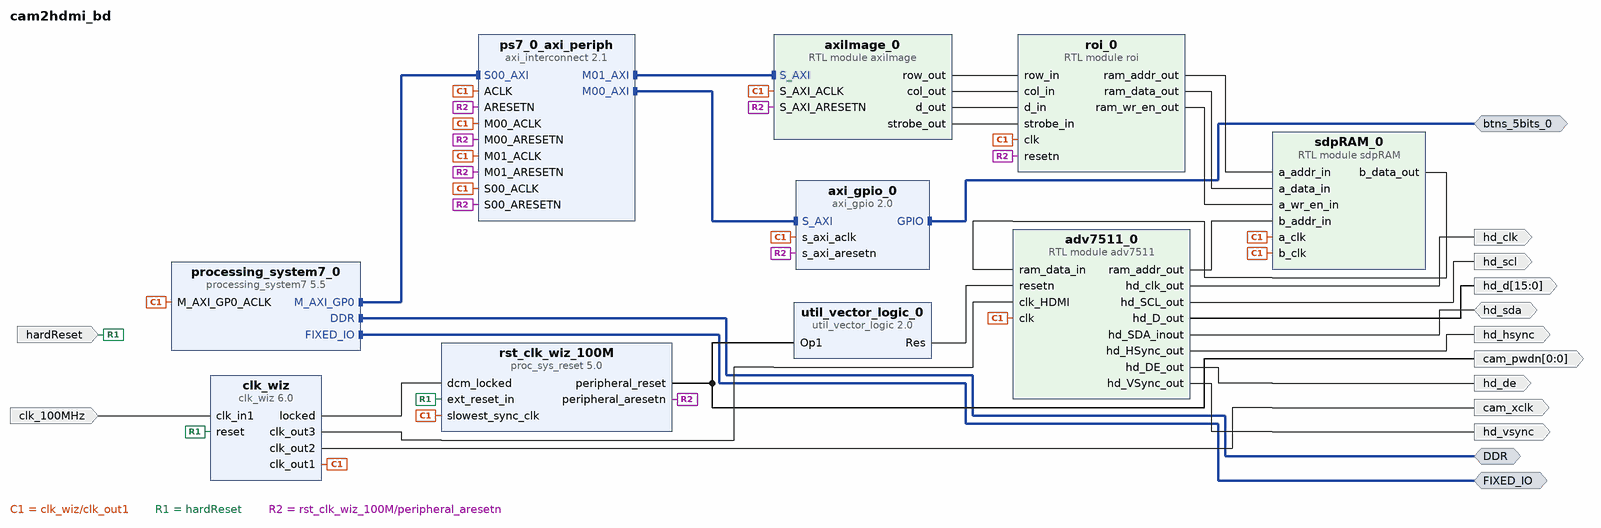
[diagram p0: block diagram of the top level]
# Vivado block design cam2hdmi_bd, xc7z020clg484-1, Vivado 2019.1
create_bd_design cam2hdmi_bd

create_bd_intf_port -mode Master -vlnv xilinx.com:interface:ddrx_rtl:1.0 DDR
create_bd_intf_port -mode Master -vlnv xilinx.com:display_processing_system7:fixedio_rtl:1.0 FIXED_IO
create_bd_intf_port -mode Master -vlnv xilinx.com:interface:gpio_rtl:1.0 btns_5bits_0
create_bd_port -dir I -type clk clk_100MHz
set_property -dict {CONFIG.FREQ_HZ 100000000} [get_bd_ports clk_100MHz]
create_bd_port -dir I -type rst hardReset
set_property -dict {CONFIG.POLARITY ACTIVE_HIGH} [get_bd_ports hardReset]
create_bd_port -dir O -from 0 -to 0 -type rst cam_pwdn
create_bd_port -dir O -type data hd_scl
create_bd_port -dir IO -type data hd_sda
create_bd_port -dir O -type data hd_clk
create_bd_port -dir O -type data hd_vsync
create_bd_port -dir O -type data hd_hsync
create_bd_port -dir O -from 15 -to 0 -type data hd_d
create_bd_port -dir O -type data hd_de
create_bd_port -dir O -type clk cam_xclk

create_bd_cell -type ip -vlnv xilinx.com:ip:util_vector_logic:2.0 util_vector_logic_0
set_property -dict {CONFIG.C_OPERATION not CONFIG.C_SIZE 1} [get_bd_cells util_vector_logic_0]
create_bd_cell -type ip -vlnv xilinx.com:ip:processing_system7:5.5 processing_system7_0
set_property -dict [list \
  CONFIG.PCW_APU_PERIPHERAL_FREQMHZ 666.6666666 \
  CONFIG.PCW_ENET0_ENET0_IO {MIO 16 .. 27} \
  CONFIG.PCW_ENET0_GRP_MDIO_ENABLE 1 \
  CONFIG.PCW_ENET0_GRP_MDIO_IO {MIO 52 .. 53} \
  CONFIG.PCW_ENET0_PERIPHERAL_ENABLE 1 \
  CONFIG.PCW_EN_CLK0_PORT 0 \
  CONFIG.PCW_FPGA0_PERIPHERAL_FREQMHZ 25 \
  CONFIG.PCW_FPGA1_PERIPHERAL_FREQMHZ 100 \
  CONFIG.PCW_GPIO_MIO_GPIO_ENABLE 0 \
  CONFIG.PCW_PERIPHERAL_BOARD_PRESET part0 \
  CONFIG.PCW_PRESET_BANK1_VOLTAGE {LVCMOS 1.8V} \
  CONFIG.PCW_QSPI_PERIPHERAL_ENABLE 0 \
  CONFIG.PCW_SD0_GRP_CD_ENABLE 0 \
  CONFIG.PCW_SD0_GRP_WP_ENABLE 0 \
  CONFIG.PCW_SD0_PERIPHERAL_ENABLE 1 \
  CONFIG.PCW_SD0_SD0_IO {MIO 40 .. 45} \
  CONFIG.PCW_SDIO_PERIPHERAL_FREQMHZ 50 \
  CONFIG.PCW_UART1_PERIPHERAL_ENABLE 1 \
  CONFIG.PCW_UART1_UART1_IO {MIO 48 .. 49} \
  CONFIG.PCW_UART_PERIPHERAL_FREQMHZ 100 \
  CONFIG.PCW_UIPARAM_DDR_FREQ_MHZ 533.333333 \
  CONFIG.PCW_UIPARAM_DDR_PARTNO {MT41J128M16 HA-15E} \
  CONFIG.PCW_USB0_PERIPHERAL_ENABLE 0 \
  CONFIG.preset ZedBoard \
] [get_bd_cells processing_system7_0]
# 407 more settings of processing_system7_0 are not shown: defaults, MIO pin electricals, DDR timing, and values the tool derives
create_bd_cell -type ip -vlnv xilinx.com:ip:clk_wiz:6.0 clk_wiz
set_property -dict [list \
  CONFIG.CLKOUT2_JITTER 175.402 \
  CONFIG.CLKOUT2_PHASE_ERROR 98.575 \
  CONFIG.CLKOUT2_REQUESTED_OUT_FREQ 25 \
  CONFIG.CLKOUT2_USED true \
  CONFIG.CLKOUT3_JITTER 130.958 \
  CONFIG.CLKOUT3_PHASE_ERROR 98.575 \
  CONFIG.CLKOUT3_USED true \
  CONFIG.MMCM_CLKOUT1_DIVIDE 40 \
  CONFIG.MMCM_CLKOUT2_DIVIDE 10 \
  CONFIG.MMCM_DIVCLK_DIVIDE 1 \
  CONFIG.NUM_OUT_CLKS 3 \
] [get_bd_cells clk_wiz]
create_bd_cell -type ip -vlnv xilinx.com:ip:proc_sys_reset:5.0 rst_clk_wiz_100M
set_property -dict {CONFIG.C_AUX_RST_WIDTH 1 CONFIG.C_EXT_RST_WIDTH 1} [get_bd_cells rst_clk_wiz_100M]
create_bd_cell -type module -reference adv7511 adv7511_0
set_property -dict [list \
  CONFIG.imSizeH_g 480 \
  CONFIG.imSizeV_g 360 \
  CONFIG.ramAddressSize_g 18 \
  CONFIG.upscalingFactor_g 2 \
] [get_bd_cells adv7511_0]
create_bd_cell -type ip -vlnv xilinx.com:ip:axi_interconnect:2.1 ps7_0_axi_periph
set_property -dict {CONFIG.NUM_MI 2} [get_bd_cells ps7_0_axi_periph]
create_bd_cell -type ip -vlnv xilinx.com:ip:axi_gpio:2.0 axi_gpio_0
set_property -dict {CONFIG.GPIO_BOARD_INTERFACE btns_5bits CONFIG.USE_BOARD_FLOW true} [get_bd_cells axi_gpio_0]
create_bd_cell -type module -reference sdpRAM sdpRAM_0
create_bd_cell -type module -reference roi roi_0
create_bd_cell -type module -reference axiImage axiImage_0

# ---- connections ----

connect_bd_intf_net [get_bd_intf_ports btns_5bits_0] [get_bd_intf_pins axi_gpio_0/GPIO]
connect_bd_intf_net [get_bd_intf_pins processing_system7_0/M_AXI_GP0] [get_bd_intf_pins ps7_0_axi_periph/S00_AXI]
connect_bd_intf_net [get_bd_intf_pins ps7_0_axi_periph/M01_AXI] [get_bd_intf_pins axiImage_0/S_AXI]
connect_bd_intf_net [get_bd_intf_ports DDR] [get_bd_intf_pins processing_system7_0/DDR]
connect_bd_intf_net [get_bd_intf_pins ps7_0_axi_periph/M00_AXI] [get_bd_intf_pins axi_gpio_0/S_AXI]
connect_bd_intf_net [get_bd_intf_ports FIXED_IO] [get_bd_intf_pins processing_system7_0/FIXED_IO]
connect_bd_net [get_bd_pins clk_wiz/clk_out1] \
  [get_bd_pins processing_system7_0/M_AXI_GP0_ACLK] [get_bd_pins rst_clk_wiz_100M/slowest_sync_clk] \
  [get_bd_pins adv7511_0/clk] [get_bd_pins ps7_0_axi_periph/S00_ACLK] [get_bd_pins ps7_0_axi_periph/M00_ACLK] \
  [get_bd_pins ps7_0_axi_periph/ACLK] [get_bd_pins axi_gpio_0/s_axi_aclk] [get_bd_pins sdpRAM_0/a_clk] \
  [get_bd_pins sdpRAM_0/b_clk] [get_bd_pins roi_0/clk] [get_bd_pins axiImage_0/S_AXI_ACLK] \
  [get_bd_pins ps7_0_axi_periph/M01_ACLK]
connect_bd_net [get_bd_pins clk_wiz/locked] [get_bd_pins rst_clk_wiz_100M/dcm_locked]
connect_bd_net [get_bd_ports clk_100MHz] [get_bd_pins clk_wiz/clk_in1]
connect_bd_net [get_bd_ports hardReset] [get_bd_pins clk_wiz/reset] [get_bd_pins rst_clk_wiz_100M/ext_reset_in]
connect_bd_net [get_bd_pins rst_clk_wiz_100M/peripheral_reset] [get_bd_ports cam_pwdn] [get_bd_pins util_vector_logic_0/Op1]
connect_bd_net [get_bd_pins util_vector_logic_0/Res] [get_bd_pins adv7511_0/resetn]
connect_bd_net [get_bd_pins adv7511_0/hd_SCL_out] [get_bd_ports hd_scl]
connect_bd_net [get_bd_ports hd_sda] [get_bd_pins adv7511_0/hd_SDA_inout]
connect_bd_net [get_bd_pins adv7511_0/hd_clk_out] [get_bd_ports hd_clk]
connect_bd_net [get_bd_pins adv7511_0/hd_VSync_out] [get_bd_ports hd_vsync]
connect_bd_net [get_bd_pins adv7511_0/hd_HSync_out] [get_bd_ports hd_hsync]
connect_bd_net [get_bd_pins adv7511_0/hd_D_out] [get_bd_ports hd_d]
connect_bd_net [get_bd_pins adv7511_0/hd_DE_out] [get_bd_ports hd_de]
connect_bd_net [get_bd_pins clk_wiz/clk_out2] [get_bd_ports cam_xclk]
connect_bd_net [get_bd_pins clk_wiz/clk_out3] [get_bd_pins adv7511_0/clk_HDMI]
connect_bd_net [get_bd_pins rst_clk_wiz_100M/peripheral_aresetn] \
  [get_bd_pins ps7_0_axi_periph/S00_ARESETN] [get_bd_pins ps7_0_axi_periph/M00_ARESETN] \
  [get_bd_pins ps7_0_axi_periph/ARESETN] [get_bd_pins axi_gpio_0/s_axi_aresetn] [get_bd_pins roi_0/resetn] \
  [get_bd_pins axiImage_0/S_AXI_ARESETN] [get_bd_pins ps7_0_axi_periph/M01_ARESETN]
connect_bd_net [get_bd_pins roi_0/ram_addr_out] [get_bd_pins sdpRAM_0/a_addr_in]
connect_bd_net [get_bd_pins roi_0/ram_data_out] [get_bd_pins sdpRAM_0/a_data_in]
connect_bd_net [get_bd_pins roi_0/ram_wr_en_out] [get_bd_pins sdpRAM_0/a_wr_en_in]
connect_bd_net [get_bd_pins sdpRAM_0/b_data_out] [get_bd_pins adv7511_0/ram_data_in]
connect_bd_net [get_bd_pins axiImage_0/row_out] [get_bd_pins roi_0/row_in]
connect_bd_net [get_bd_pins axiImage_0/col_out] [get_bd_pins roi_0/col_in]
connect_bd_net [get_bd_pins axiImage_0/d_out] [get_bd_pins roi_0/d_in]
connect_bd_net [get_bd_pins axiImage_0/strobe_out] [get_bd_pins roi_0/strobe_in]
connect_bd_net [get_bd_pins adv7511_0/ram_addr_out] [get_bd_pins sdpRAM_0/b_addr_in]

# ---- address map ----
assign_bd_address -offset 0x41200000 -range 64K -target_address_space [get_bd_addr_spaces processing_system7_0/Data] [get_bd_addr_segs axi_gpio_0/S_AXI/Reg]
assign_bd_address -offset 0x43C00000 -range 64K -target_address_space [get_bd_addr_spaces processing_system7_0/Data] [get_bd_addr_segs axiImage_0/S_AXI/reg0]

validate_bd_design
save_bd_design
